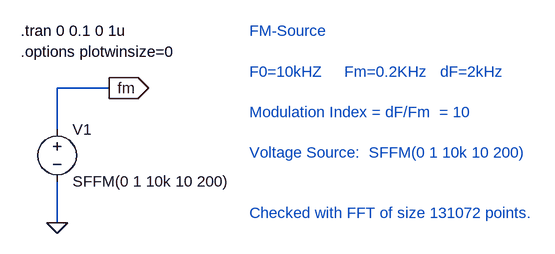
[diagram p0: schematic FM_voltage_source.asc]
FM_voltage_source.asc, the LTspice schematic file:
Version 4
SHEET 1 880 680
WIRE -48 224 -48 160
WIRE -48 160 32 160
WIRE -48 304 -48 368
FLAG -48 368 0
FLAG 32 160 fm
IOPIN 32 160 Out
SYMBOL voltage -48 208 R0
WINDOW 123 0 0 Left 0
WINDOW 39 0 0 Left 0
SYMATTR InstName V1
SYMATTR Value SFFM(0 1 10k 10 200)
TEXT -104 72 Left 0 !.tran 0 0.1 0 1u
TEXT -104 104 Left 0 !.options plotwinsize=0
TEXT 248 72 Left 0 ;FM-Source\n \nF0=10kHZ     Fm=0.2KHz   dF=2kHz\n \nModulation Index = dF/Fm  = 10\n \nVoltage Source:  SFFM(0 1 10k 10 200)\n \n\nChecked with FFT of size 131072 points.

The netlist it stands for:
* FM_voltage_source.asc
V1 fm 0 SFFM(0 1 10k 10 200)
.tran 0 0.1 0 1u
.options plotwinsize=0
* FM-Source
* F0=10kHZ     Fm=0.2KHz   dF=2kHz
* Modulation Index = dF/Fm  = 10
* Voltage Source:  SFFM(0 1 10k 10 200)
* Checked with FFT of size 131072 points.
.backanno
.end